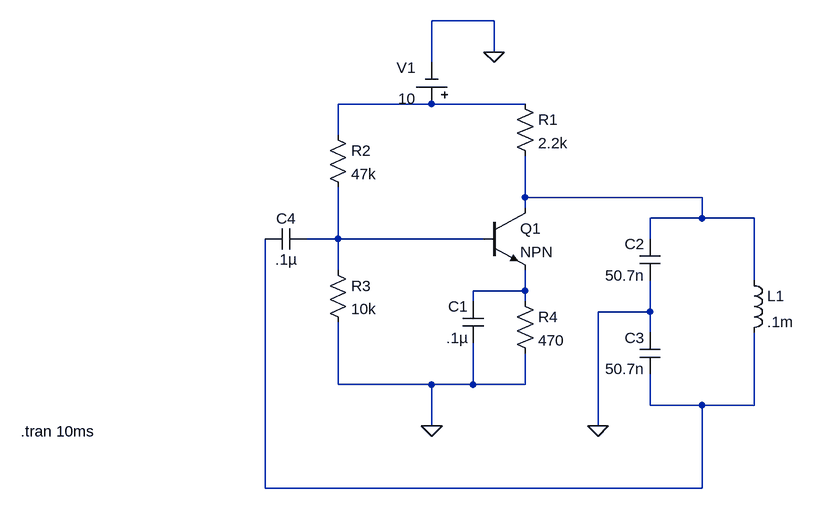
[diagram p0: schematic Colpitts Oscillator Circuit.asc]
Colpitts Oscillator Circuit.asc, the LTspice schematic file:
Version 4
SHEET 1 880 680
WIRE 192 -240 96 -240
WIRE 192 -192 192 -240
WIRE 96 -176 96 -240
WIRE 96 -112 -48 -112
WIRE 240 -112 96 -112
WIRE -48 -64 -48 -112
WIRE 240 32 240 -32
WIRE 512 32 240 32
WIRE 240 48 240 32
WIRE 512 64 512 32
WIRE 512 64 432 64
WIRE 592 64 512 64
WIRE -48 96 -48 16
WIRE -48 96 -96 96
WIRE 176 96 -48 96
WIRE 432 96 432 64
WIRE -48 144 -48 96
WIRE 592 160 592 64
WIRE 240 176 240 144
WIRE 240 176 160 176
WIRE 160 192 160 176
WIRE 240 192 240 176
WIRE 432 208 432 160
WIRE 432 208 352 208
WIRE 432 240 432 208
WIRE -48 320 -48 224
WIRE 96 320 -48 320
WIRE 160 320 160 256
WIRE 160 320 96 320
WIRE 240 320 240 272
WIRE 240 320 160 320
WIRE 432 352 432 304
WIRE 512 352 432 352
WIRE 592 352 592 240
WIRE 592 352 512 352
WIRE 96 384 96 320
WIRE 352 384 352 208
WIRE -160 480 -160 96
WIRE 512 480 512 352
WIRE 512 480 -160 480
FLAG 96 384 0
FLAG 352 384 0
FLAG 192 -192 0
SYMBOL res 224 -128 R0
SYMATTR InstName R1
SYMATTR Value 2.2k
SYMBOL res -64 -80 R0
SYMATTR InstName R2
SYMATTR Value 47k
SYMBOL res 224 176 R0
SYMATTR InstName R4
SYMATTR Value 470
SYMBOL res -64 128 R0
SYMATTR InstName R3
SYMATTR Value 10k
SYMBOL cap 176 256 R180
WINDOW 0 24 56 Left 2
WINDOW 3 24 8 Left 2
SYMATTR InstName C1
SYMATTR Value .1µ
SYMBOL cap 448 160 R180
WINDOW 0 24 56 Left 2
WINDOW 3 24 8 Left 2
SYMATTR InstName C2
SYMATTR Value 50.7n
SYMBOL cap 448 304 R180
WINDOW 0 24 56 Left 2
WINDOW 3 24 8 Left 2
SYMATTR InstName C3
SYMATTR Value 50.7n
SYMBOL ind 576 144 R0
SYMATTR InstName L1
SYMATTR Value .1m
SYMBOL cap -96 80 R90
WINDOW 0 0 32 VBottom 2
WINDOW 3 32 32 VTop 2
SYMATTR InstName C4
SYMATTR Value .1µ
SYMBOL Misc\\cell 96 -112 R180
WINDOW 0 24 56 Left 2
WINDOW 3 24 8 Left 2
WINDOW 123 0 0 Left 0
WINDOW 39 0 0 Left 0
SYMATTR InstName V1
SYMATTR Value 10
SYMBOL npn 176 48 R0
SYMATTR InstName Q1
TEXT -536 392 Left 2 !.tran 10ms

The netlist it stands for:
* Colpitts Oscillator Circuit.asc
R1 N001 N002 2.2k
R2 N001 N003 47k
R4 N004 0 470
R3 N003 0 10k
C1 0 N004 .1µ
C2 0 N002 50.7n
C3 N005 0 50.7n
L1 N002 N005 .1m
C4 N003 N005 .1µ
V1 N001 0 10
Q1 N002 N003 N004 0 NPN
.model NPN NPN
.model PNP PNP
.lib standard.bjt
.tran 10ms
.backanno
.end